# EAGLE design untitled (EAGLE 7.2.0)
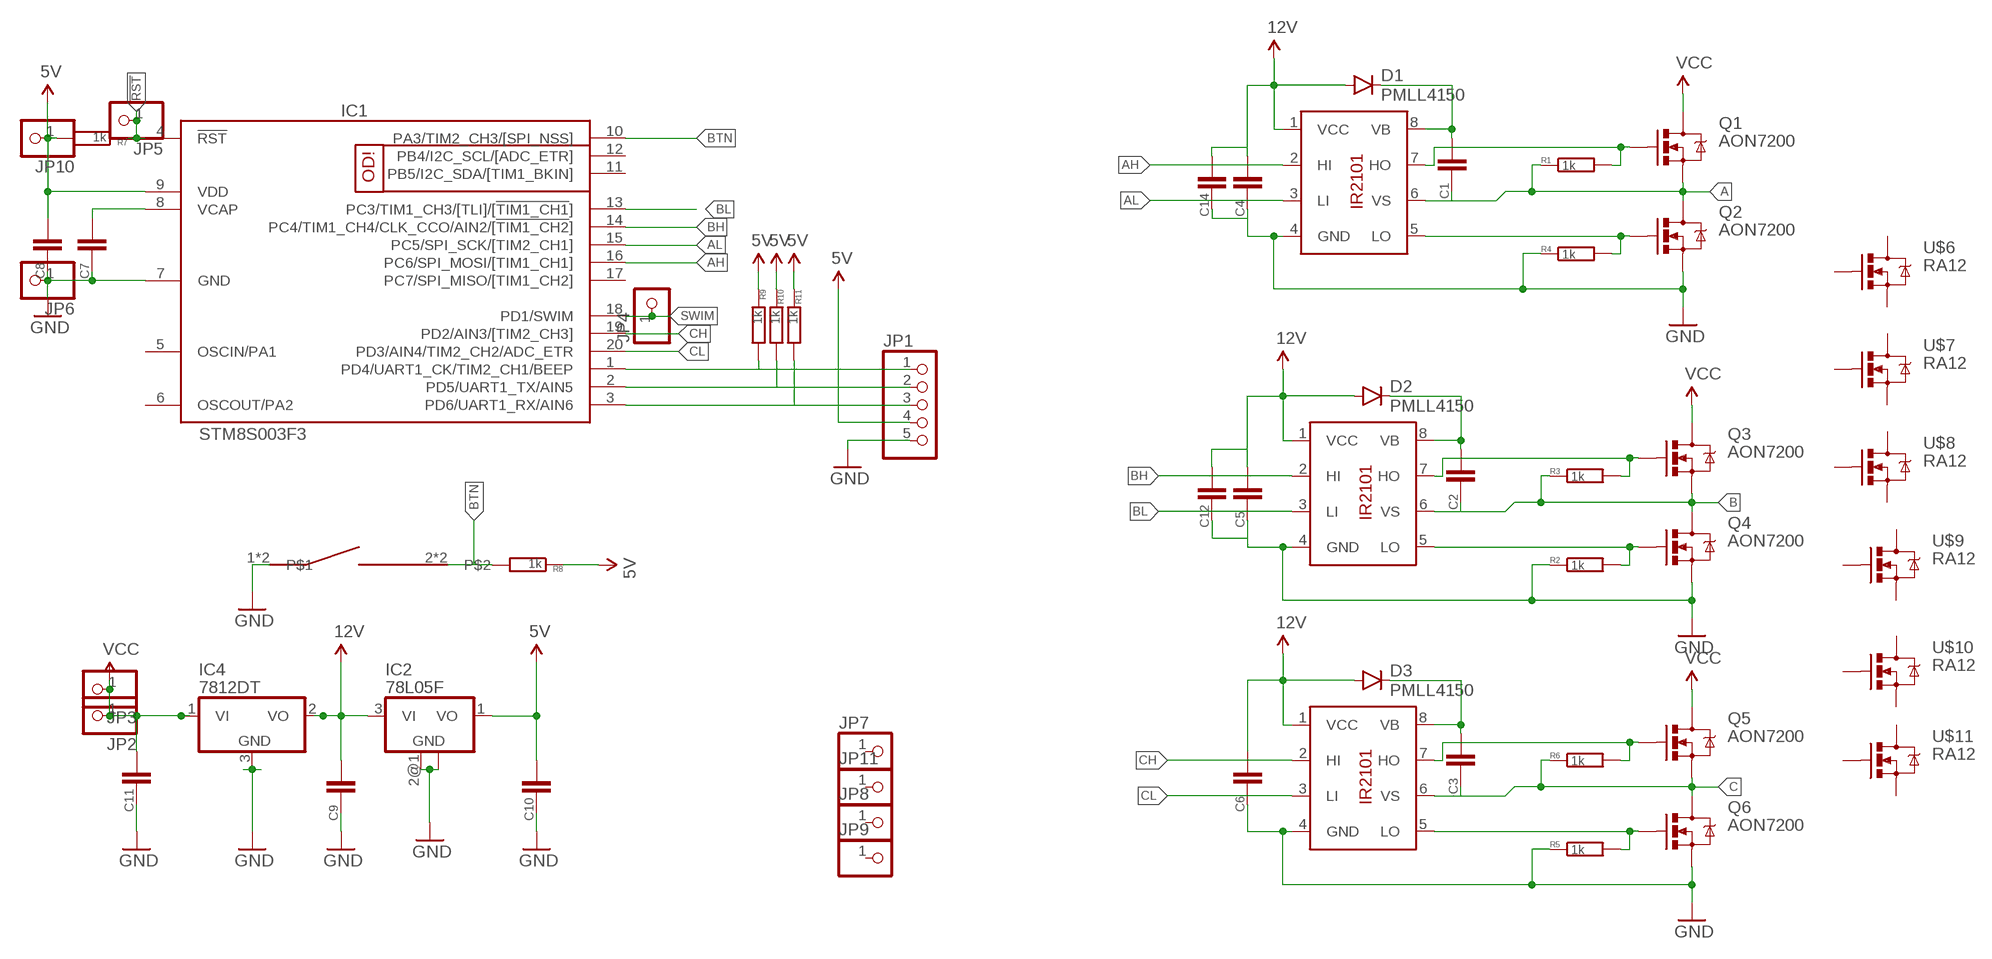
[diagram p0: schematic, sheet 1]

## Parts
C1  CC0805  [C0805]
C2  CC0805  [C0805]
C3  CC0805  [C0805]
C4  CC0805  [C0805]
C5  CC0805  [C0805]
C6  CC0805  [C0805]
C7  CC0603  [C0603]
C8  CC0805  [C0805]
C9  CC0805  [C0805]
C10  CC0805  [C0805]
C11  CC0805  [C0805]
C12  CC0805  [C0805]
C14  CC0805  [C0805]
D1  PMLL4150  [SOD80C]
D2  PMLL4150  [SOD80C]
D3  PMLL4150  [SOD80C]
IC1  STM8S003F3  [TSSOP20]
IC2  78L05F  [SOT89]
IC4  7812DT  [TO252]
JP1  PINHD-1X05_2.00  [1X05M]
JP2  PINHD-1X1  [1X01]
JP3  PINHD-1X1  [1X01]
JP4  PINHD-1X1  [1X01]
JP5  PINHD-1X1  [1X01]
JP6  PINHD-1X1  [1X01]
JP7  PINHD-1X01_2.54-90°  [1X01/90]
JP8  PINHD-1X01_2.54-90°  [1X01/90]
JP9  PINHD-1X01_2.54-90°  [1X01/90]
JP10  PINHD-1X1  [1X01]
JP11  PINHD-1X01_2.54-90°  [1X01/90]
Q1  AON7200  [DFN3X3]
Q2  AON7200  [DFN3X3]
Q3  AON7200  [DFN3X3]
Q4  AON7200  [DFN3X3]
Q5  AON7200  [DFN3X3]
Q6  AON7200  [DFN3X3]
R1  1k  R0603  [0603]
R2  1k  R0603  [0603]
R3  1k  R0603  [0603]
R4  1k  R0603  [0603]
R5  1k  R0603  [0603]
R6  1k  R0603  [0603]
R7  1k  R0603  [0603]
R8  1k  R0603  [0603]
R9  1k  R0603  [0603]
R10  1k  R0603  [0603]
R11  1k  R0603  [0603]
U$1  IR2101  [SO08]
U$2  IR2101  [SO08]
U$4  IR2101  [SO08]
U$5  BUTTON1  [BUTTON1]
U$6  RA12  [POWERPAK_SO8]
U$7  RA12  [POWERPAK_SO8]
U$8  RA12  [POWERPAK_SO8]
U$9  RA12  [POWERPAK_SO8]
U$10  RA12  [POWERPAK_SO8]
U$11  RA12  [POWERPAK_SO8]

## Nets
5V: C8.1 C10.1 IC1.9(VDD) IC2.1(VO) JP1.4 JP10.1 R7.2 R8.1 R9.1 R10.1 R11.1
12V: C4.1 C5.1 C6.1 C9.1 C12.1 C14.1 D1.A D2.A D3.A IC2.3(VI) IC4.2(VO) U$1.1(VCC) U$2.1(VCC) U$4.1(VCC)
!RST: IC1.4(!RST) JP5.1 R7.1
A: C1.2 Q1.S:1(S) Q1.S:2(S) Q1.S:3(S) Q2.D Q2.D:1(D) Q2.D:2(D) Q2.D:3(D) Q2.D:4(D) Q2.D:5(D) Q2.D:6(D) R1.1 U$1.6(VS)
AH: IC1.16(PC6/SPI_MOSI/[TIM1_CH1]) U$1.2(HI)
AL: IC1.15(PC5/SPI_SCK/[TIM2_CH1]) U$1.3(LI)
B: C2.2 Q3.S:1(S) Q3.S:2(S) Q3.S:3(S) Q4.D Q4.D:1(D) Q4.D:2(D) Q4.D:3(D) Q4.D:4(D) Q4.D:5(D) Q4.D:6(D) R3.1 U$2.6(VS)
BH: IC1.14(PC4/TIM1_CH4/CLK_CCO/AIN2/[!TIM1_CH2!]) U$2.2(HI)
BL: IC1.13(PC3/TIM1_CH3/[TLI]/[!TIM1_CH1!]) U$2.3(LI)
BTN: IC1.10(PA3/TIM2_CH3/[SPI_NSS]) R8.2 U$5.2 U$5.4
C: C3.2 Q5.S:1(S) Q5.S:2(S) Q5.S:3(S) Q6.D Q6.D:1(D) Q6.D:2(D) Q6.D:3(D) Q6.D:4(D) Q6.D:5(D) Q6.D:6(D) R6.1 U$4.6(VS)
CH: IC1.19(PD2/AIN3/[TIM2_CH3]) U$4.2(HI)
CL: IC1.20(PD3/AIN4/TIM2_CH2/ADC_ETR) U$4.3(LI)
GND: C4.2 C5.2 C6.2 C7.2 C8.2 C9.2 C10.2 C11.2 C12.2 C14.2 IC1.7(GND) IC2.2(GND) IC2.2@1(GND) IC4.3(GND) JP1.5 JP6.1 Q2.S:1(S) Q2.S:2(S) Q2.S:3(S) Q4.S:1(S) Q4.S:2(S) Q4.S:3(S) Q6.S:1(S) Q6.S:2(S) Q6.S:3(S) R2.1 R4.1 R5.1 U$1.4(GND) U$2.4(GND) U$4.4(GND) U$5.1 U$5.3
N$1: Q3.G R3.2 U$2.7(HO)
N$2: C2.1 D2.C U$2.8(VB)
N$3: Q4.G R2.2 U$2.5(LO)
N$4: Q1.G R1.2 U$1.7(HO)
N$5: C1.1 D1.C U$1.8(VB)
N$7: Q5.G R6.2 U$4.7(HO)
N$8: Q2.G R4.2 U$1.5(LO)
N$10: C3.1 D3.C U$4.8(VB)
N$11: Q6.G R5.2 U$4.5(LO)
N$13: IC1.1(PD4/UART1_CK/TIM2_CH1/BEEP) JP1.1 R9.2
N$14: IC1.2(PD5/UART1_TX/AIN5) JP1.2 R10.2
N$15: IC1.3(PD6/UART1_RX/AIN6) JP1.3 R11.2
N$19: C7.1 IC1.8(VCAP)
SWIM: IC1.18(PD1/SWIM) JP4.1
VCC: C11.1 IC4.1(VI) JP2.1 JP3.1 Q1.D Q1.D:1(D) Q1.D:2(D) Q1.D:3(D) Q1.D:4(D) Q1.D:5(D) Q1.D:6(D) Q3.D Q3.D:1(D) Q3.D:2(D) Q3.D:3(D) Q3.D:4(D) Q3.D:5(D) Q3.D:6(D) Q5.D Q5.D:1(D) Q5.D:2(D) Q5.D:3(D) Q5.D:4(D) Q5.D:5(D) Q5.D:6(D)
Unconnected: IC1.5(OSCIN/PA1) IC1.6(OSCOUT/PA2) IC1.11(PB5/I2C_SDA/[TIM1_BKIN]) IC1.12(PB4/I2C_SCL/[ADC_ETR]) IC1.17(PC7/SPI_MISO/[TIM1_CH2]) JP7.1 JP8.1 JP9.1 JP11.1 U$6.1(S) U$6.2(S) U$6.3(S) U$6.4(G) U$6.5(D) U$6.6(D) U$6.7(D) U$6.8(D) U$7.1(S) U$7.2(S) U$7.3(S) U$7.4(G) U$7.5(D) U$7.6(D) U$7.7(D) U$7.8(D) U$8.1(S) U$8.2(S) U$8.3(S) U$8.4(G) U$8.5(D) U$8.6(D) U$8.7(D) U$8.8(D) U$9.1(S) U$9.2(S) U$9.3(S) U$9.4(G) U$9.5(D) U$9.6(D) U$9.7(D) U$9.8(D) U$10.1(S) U$10.2(S) U$10.3(S) U$10.4(G) U$10.5(D) U$10.6(D) U$10.7(D) U$10.8(D) U$11.1(S) U$11.2(S) U$11.3(S) U$11.4(G) U$11.5(D) U$11.6(D) U$11.7(D) U$11.8(D)

## Library data of the parts
C1-C12 C14 = smalsmd:C: Capacitor
D1-D3 = DIODE:PMLL4150
IC1 = stm8:STM8S003: Value line, 16 MHz STM8S 8-bit MCU, 8 Kbytes Flash, 128 bytes data EEPROM, 10-bit ADC, 3 timers, UART, SPI, I2C
IC2 = linear:78L*: POSITOIV-VOLTAGE REGULATORS Output up to 100 mA Source: Datasheet <http://focus.ti.com/lit/ds/symlink/ua78l05.pdf>
IC4 = linear:78*: Positive VOLTAGE REGULATOR Source: http://cache.national.com/ds/LM/LM78L05.pdf http://www.fairchildsemi.com/ds/LM/LM7805.pdf
JP1 = pinhead-2:PINHD-1X05: PIN HEADER
JP2-JP6 JP10 = pinhead:PINHD-1X1: PIN HEADER
JP7-JP9 JP11 = pinhead-2:PINHD-1X01: PIN HEADER
Q1-Q6 = smalsmd:AON7200
R1-R11 = smalsmd:R
U$1 U$2 U$4 = gateDriver:IR2101
U$5 = smalsmd:BUTTON1
U$6-U$11 = CasaLibrary:RA12

## Board
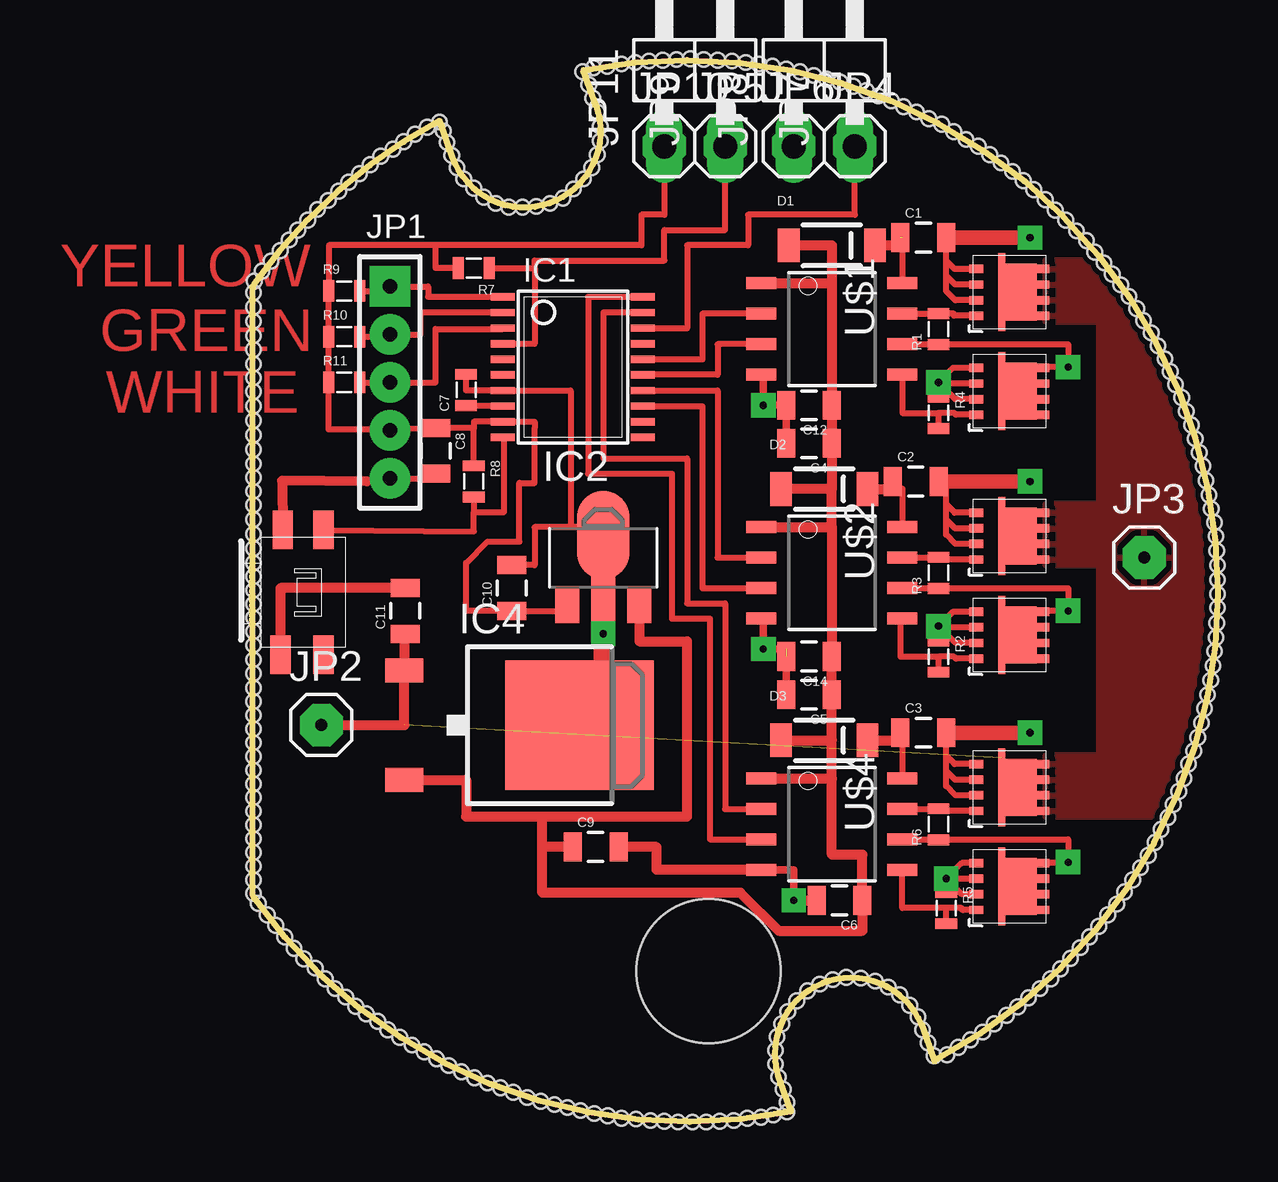
[diagram p1: board, top side]
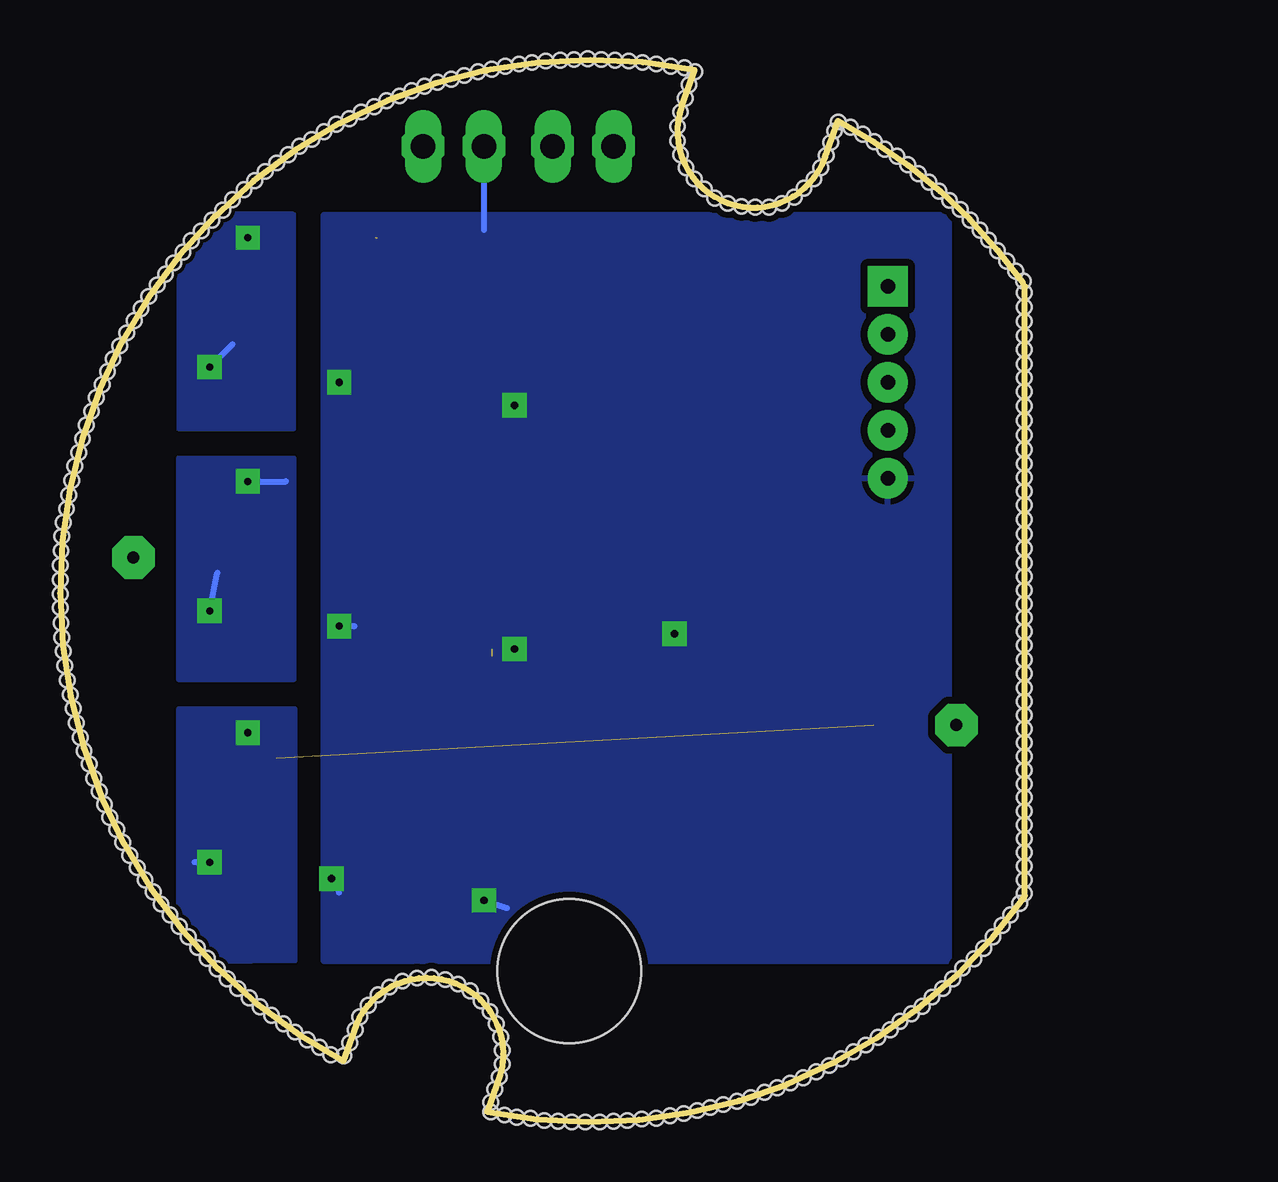
[diagram p2: board, bottom side, seen from below]

Size 40.2 x 44.26 mm. Coordinates in mm from the lower left corner, seen from the top.
Copper layers (1*16): Top 0.035mm / dielectric 1.5mm / Bottom 0.035mm
Design rules "default": minimum track width 0.2mm, minimum drill 0.2mm, track to track 0.2mm, track to pad 0.2mm, pad to pad 0.2mm, via to via 0.2mm, smd to smd 0.2mm, copper to edge 0.2mm, drill to drill 0.2mm, minimum pad ring 10mil, minimum via ring 8mil, stop-mask expansion 4mil, vias tented up to drill 0mil, thermal gap 10mil
Holes 0.6 mm at 0.02,34.57 0.02,33.97 0.02,33.36 0.02,32.76 0.02,32.19 0.02,31.59 0.02,31.02 0.02,30.44 0.02,29.84 0.02,29.24 0.02,28.63 0.02,28.03 0.02,27.43 0.02,26.86 0.02,26.28 0.02,25.71 0.02,25.11 0.02,24.51 0.02,23.9 0.02,23.3 0.02,22.73 0.02,22.16 0.02,21.59 0.02,21.01 0.02,20.44 0.02,19.87 0.02,19.27 0.02,18.7 0.02,18.09 0.02,17.52 0.02,16.95 0.02,16.38 0.02,15.81 0.02,15.24 0.02,14.66 0.02,14.09 0.02,13.52 0.02,12.95 0.02,12.38 0.02,11.81 0.02,11.23 0.02,10.66 0.02,10.09 0.02,9.52 0.21,9.11 0.59,8.63 0.94,8.19 1.32,7.71 1.71,7.23 2.12,6.79 2.59,6.41 3.01,5.96 3.42,5.55 3.86,5.2 4.28,4.82 4.72,4.5 5.2,4.19 5.61,3.84 6.12,3.52 6.63,3.2 7.13,2.92 7.64,2.63 8.15,2.34 8.69,2.09 9.23,1.84 9.77,1.61 10.31,1.42 10.85,1.23 11.42,1.01 11.99,0.85 12.56,0.73 13.1,0.6 13.64,0.47 14.22,0.34 14.79,0.25 15.36,0.15 15.96,0.12 16.56,0.06 17.14,0.03 17.71,0 18.31,0 18.88,0 19.45,0.03 20.03,0.06 20.6,0.15 21.17,0.19 21.68,0.28 22.25,0.41 22.25,0.82 22.09,1.36 21.9,1.87 21.77,2.41 21.77,2.98 21.84,3.55 22.03,4.09 22.28,4.6 22.66,5.04 23.11,5.46 23.61,5.74 24.15,5.93 24.72,6.03 25.33,6 25.93,5.87 26.47,5.62 26.95,5.3 27.36,4.85 27.71,4.38 27.9,3.84 28.12,3.3 28.38,2.76 28.92,2.79 29.39,3.11 29.9,3.42 30.41,3.74 30.88,4.09 31.39,4.44 31.87,4.79 32.31,5.17 32.79,5.55 33.23,5.96 33.65,6.38 34.06,6.82 34.47,7.27 34.85,7.71 35.23,8.16 35.61,8.63 36,9.08 36.31,9.58 36.66,10.09 36.98,10.6 37.3,11.11 37.58,11.65 37.84,12.19 38.12,12.7 38.35,13.24 38.57,13.77 38.79,14.31 38.98,14.92 39.2,15.46 39.36,16.03 39.52,16.63 39.65,17.24 39.77,17.81 39.9,18.41 40,19.01 40.06,19.62 40.12,20.19 40.15,20.79 40.19,21.43 40.19,22 40.19,22.6 40.19,23.2 40.15,23.81 40.12,24.41 40.06,24.98 39.93,25.55 39.84,26.13 39.71,26.73 39.58,27.33 39.42,27.9 39.27,28.48 39.11,29.05 38.88,29.62 38.69,30.19 38.44,30.73 38.22,31.27 38,31.81 37.71,32.35 37.42,32.89 37.11,33.4 36.82,33.9 36.5,34.41 36.15,34.89 35.81,35.33 35.46,35.81 35.07,36.25 34.73,36.73 34.31,37.14 33.87,37.59 33.42,38 33.01,38.44 32.53,38.86 32.09,39.24 31.65,39.62 31.17,39.97 30.69,40.32 30.22,40.67 29.71,40.95 29.2,41.27 28.69,41.59 28.15,41.81 27.65,42.1 27.11,42.32 26.6,42.57 26.06,42.76 25.55,42.98 25.01,43.18 24.47,43.33 23.9,43.46 23.36,43.62 22.79,43.78 22.22,43.87 21.64,44 21.07,44.1 20.53,44.16 19.96,44.22 19.36,44.25 18.79,44.29 18.22,44.32 17.64,44.29 17.07,44.25 16.5,44.22 15.93,44.16 15.36,44.1 14.75,44 14.18,43.94 13.74,43.78 13.99,43.24 14.15,42.67 14.34,42.1 14.47,41.49 14.47,40.89 14.34,40.32 14.12,39.78 13.77,39.3 13.36,38.89 12.91,38.51 12.37,38.29 11.8,38.16 11.23,38.13 10.66,38.13 10.12,38.29 9.61,38.54 9.2,38.92 8.79,39.3 8.5,39.78 8.28,40.29 8.09,40.83 7.93,41.3 7.77,41.68 7.26,41.46 6.75,41.18 6.28,40.86 5.83,40.54 5.33,40.25 4.88,39.91 4.44,39.52 3.99,39.17 3.58,38.79 3.13,38.41 2.69,38.03 2.28,37.59 1.86,37.17 1.52,36.76 1.13,36.32 0.75,35.87 0.37,35.46 0.05,35.05

### Footprints (pad centres in the part's own frame; a part is rotated, then mirrored left to right if it is on the bottom)
C0805 = smd 0.75 x 1.2: 1 -0.953,0; 2 0.953,0
C0603 = smd 0.45 x 0.9: 1 -0.65,0; 2 0.65,0
SOD80C = smd 0.9 x 1.4: A -1.8,0; C 1.8,0
TSSOP20 = smd 0.305 x 0.991: 1 -2.925,-2.918; 2 -2.275,-2.918; 3 -1.625,-2.918; 4 -0.975,-2.918; 5 -0.325,-2.918; 6 0.325,-2.918; 7 0.975,-2.918; 8 1.625,-2.918; 9 2.275,-2.918; 10 2.925,-2.918; 11 2.925,2.918; 12 2.275,2.918; 13 1.625,2.918; 14 0.975,2.918; 15 0.325,2.918; 16 -0.325,2.918; 17 -0.975,2.918; 18 -1.625,2.918; 19 -2.275,2.918; 20 -2.925,2.918
SOT89 = smd 1 x 1.5: 1 -1.499,-1.981; 3 1.499,-1.981 | smd 1 x 2: 2 0,-1.727 | smd 2.2 x 3.7: 2@1 0,0.94
TO252 = smd 1 x 1.6: 1 -2.28,-4.8; 2 2.28,-4.8 | smd 5.4 x 6.2: 3 0,2.5
1X05M = drill 0.6 pad 1.676 square: 1 -4,0 | drill 0.6 pad 1.676: 2 -2,0; 3 0,0; 4 2,0; 5 4,0
1X01 = drill 0.5 pad 1.778 octagon: 1 0,0
1X01/90 = drill 1.016 long: 1 -1.27,-3.81
DFN3X3 = smd 1.6 x 2.375: D -0.425,0.05 | smd 0.3 x 0.8: D:1 0.225,1.275; D:2 0.225,-1.175 | smd 0.6 x 0.35: D:3 -1.461,-0.916; D:4 -1.461,-0.266; D:5 -1.461,0.384; D:6 -1.461,1.034; G 1.289,1.034; S:1 1.289,0.384; S:2 1.289,-0.266; S:3 1.289,-0.916
0603 = smd 0.45 x 0.9: 1 -0.65,0; 2 0.65,0
SO08 = smd 0.5 x 1.25: 1 -1.905,-2.934; 2 -0.635,-2.934; 3 0.635,-2.934; 4 1.905,-2.934; 5 1.905,2.934; 6 0.635,2.934; 7 -0.635,2.934; 8 -1.905,2.934
AOKT-1 = hole 6: 16.008,1.202
BUTTON1 = smd 0.85 x 1.6: 1 0.9,4.9; 2 2.6,4.9; 3 0.8,-0.3; 4 2.6,-0.3
POWERPAK_SO8 = smd 0.66 x 0.5: 1 -2.921,1.778; 2 -2.921,0.508; 3 -2.921,-0.762; 4 -2.921,-2.032; 5 2.413,-2.032; 6 2.413,-0.762; 7 2.413,0.508; 8 2.413,1.778

### Placement (x,y rotation side)
C1  27.93,36.86 0 top
C2  27.61,26.7 0 top
C3  27.93,16.22 0 top
C4  23.17,28.28 180 top
C5  23.17,17.81 180 top
C6  24.44,9.23 180 top
C7  8.88,30.51 90 top
C8  7.61,27.97 270 top
C9  14.28,11.46 0 top
C10  10.79,22.25 90 top
C11  6.34,21.3 90 top
C12  23.17,29.87 180 top
C14  23.17,19.39 180 top
D1  24.12,36.54 0 top
D2  23.8,26.38 0 top
D3  23.8,15.9 0 top
IC1  13.33,31.46 270 top
IC2  14.6,23.52 0 top
IC4  11.1,16.54 270 top
JP1  5.71,30.82 270 top
JP2  2.85,16.54 0 top
JP3  37.14,23.52 0 top
JP4  25.07,40.67 0 top
JP5  19.68,40.67 0 top
JP6  22.53,40.67 0 top
JP7  26.34,44.48 0 top
JP8  23.8,44.48 0 top
JP9  20.95,44.48 0 top
JP10  17.14,40.67 0 top
JP11  18.41,44.48 0 top
Q1  31.42,34.63 180 top
Q2  31.42,30.51 180 top
Q3  31.42,24.47 180 top
Q4  31.42,20.35 180 top
Q5  31.42,14 180 top
Q6  31.42,9.87 180 top
R1  28.57,33.05 90 top
R2  28.57,19.39 270 top
R3  28.57,22.89 90 top
R4  28.57,29.55 270 top
R5  28.88,8.92 270 top
R6  28.57,12.41 90 top
R7  9.2,35.59 180 top
R8  9.2,26.7 270 top
R9  3.8,34.63 0 top
R10  3.8,32.73 0 top
R11  3.8,30.82 0 top
U$1  24.12,33.05 270 top
U$2  24.12,22.89 270 top
U$3  [AOKT-1]  17.78,22.29 270 top
U$4  24.12,12.41 270 top
U$5  0.34,19.78 0 top
U$6  51.33,37.46 0 top  (outside the outline)
U$7  49.55,27.84 0 top  (outside the outline)
U$8  49.65,20.41 0 top  (outside the outline)
U$9  49.74,13.39 0 top  (outside the outline)
U$10  49.9,6.41 0 top  (outside the outline)
U$11  50.22,-0.13 0 top  (outside the outline)

### Tracks (layer width: path | path; a pad name or v marks a point on that pad's centre or on a via)
5V
  Top 0.254: 9.2,28.92 9.2,29.18 IC1.9 11.74,29.18 11.74,28.92 11.74,28.73 11.74,26.63 11.1,26.63 11.1,24.19 9.77,24.19 8.88,23.3 8.88,21.3 C10.1 13.1,21.3 | 9.2,28.92 C8.1 5.71,28.87 3.15,28.87 R11.1 R10.1 R9.1 3.17,34.33 3.17,36.54 7.61,36.54 | R8.1 9.2,28.92 | R7.2 7.61,35.59 7.61,36.54 | JP10.1 17.14,37.81 16.18,37.81 16.18,36.54 7.61,36.54
  Top 0.305: 5.71,28.87 JP1.4
  Top 0.406: 13.1,21.3 IC2.1
12V
  Top 0.406: D1.A 24.12,36.54 24.12,34.95 | 24.12,34.95 C12.1 C4.1 24.12,26.38 | 24.12,26.38 D2.A | U$1.1 24.12,34.95 | U$2.1 24.12,24.79 | 24.12,24.79 24.12,26.38 | U$4.1 24.12,14.31 | 24.12,14.31 24.12,15.9 | D3.A 24.12,15.9 | 24.12,14.31 24.12,11.14 25.39,11.14 C6.1 25.39,7.97 21.9,7.97 20.31,9.55 12.06,9.55 12.06,11.46 | 24.12,24.79 C14.1 C5.1 24.12,15.9 | IC2.3 16.1,20.03 18.09,20.03 18.09,12.73 12.06,12.73 | IC4.2 8.88,14.26 8.88,12.73 12.06,12.73 | C9.1 12.06,11.46 | 12.06,11.46 12.06,12.73
!RST
  Top 0.254: R7.1 11.74,35.59 | 11.74,35.59 11.74,32.43 IC1.4 | 11.74,35.59 11.74,35.9 17.14,35.9 17.14,37.18 19.68,37.18 JP5.1
A  (via drill 0.3 pad 1.02)
  Top 0.254: U$1.6 28.57,32.41 R1.1 33.96,32.4 | 30.15,34.25 Q1.S:1 29.27,34.25 28.88,34.64 28.88,35.27 | Q2.D:3 32.89,31.46 v33.96,31.46 33.96,32.4 | 28.88,36.54 C1.2 28.88,35.9 | 30.15,35.59 30.15,35.55 Q1.S:3 29.24,35.55 28.88,35.9 | 28.88,35.27 28.88,35.9 | 33.96,32.41 33.96,32.4 | Q1.S:2 29.25,34.9 28.88,35.27
  Top 0.61: C1.2 v32.38,36.86
  Bottom 0.254: v33.96,31.46 33.01,32.41
  pour Bottom (no thermals): 30.47,37.81 33.65,37.81 35.23,35.59 35.23,28.92 30.47,28.92
AH
  Top 0.254: U$1.2 18.72,33.68 18.72,31.78 IC1.16
AL
  Top 0.254: U$1.3 19.36,32.41 19.36,31.14 IC1.15
B  (via drill 0.3 pad 1.02)
  Top 0.254: U$2.6 28.57,22.25 | 28.57,22.25 R3.1 | Q4.D:3 32.89,21.3 v33.96,21.3 33.96,22.25 28.57,22.25 | 30.15,24.09 Q3.S:1 29.27,24.09 28.88,24.48 28.88,25.11 | 30.14,25.43 Q3.S:3 29.24,25.39 28.88,25.75 | Q3.S:2 29.25,24.74 28.88,25.11 | 28.88,25.11 28.88,25.75 | 28.88,25.75 28.88,26.38 C2.2
  Top 0.61: v32.38,26.7 C2.2
  Bottom 0.254: v32.38,26.7 30.79,26.7 | v33.96,21.3 33.65,22.89
  pour Bottom: 30.47,27.65 30.47,18.44 35.23,18.44 35.23,27.65
BH
  Top 0.254: IC1.14 19.36,30.48 19.36,23.52 U$2.2
BL
  Top 0.254: IC1.13 18.72,29.84 18.72,22.25 U$2.3
BTN
  Top 0.254: IC1.10 10.47,28.54 10.47,25.43 9.2,25.43 | R8.2 9.2,25.43 | U$5.2 9.2,24.61 9.2,25.43
C  (via drill 0.3 pad 1.02)
  Top 0.254: U$4.6 28.57,11.78 | Q6.D:2 31.2,10.82 v33.96,10.82 33.96,11.78 28.57,11.78 | 30.14,14.95 Q5.S:3 29.24,14.91 28.88,15.27 | 28.88,14.63 28.88,15.27 | 28.88,15.27 C3.2 | R6.1 28.57,11.78 | Q5.S:1 29.27,13.61 28.88,14 28.88,14.63 | Q5.S:2 29.25,14.26 28.88,14.63
  Top 0.61: C3.2 v32.38,16.22
  Bottom 0.254: v33.96,10.82 34.6,10.82
  pour Bottom: 30.44,17.2 30.44,6.73 33.96,6.69 34.6,7.33 35.23,8.28 35.23,17.2
CH
  Top 0.254: U$4.2 19.68,13.05 19.68,21.62 18.09,21.62 18.09,27.65 14.6,27.65 14.6,33.74 IC1.19
CL
  Top 0.254: U$4.3 19.04,11.78 19.04,20.98 17.45,20.98 17.45,27.02 13.96,27.02 13.96,34.39 IC1.20
GND  (via drill 0.3 pad 1.02)  (1 unrouted)
  Top 0.254: 30.15,30.12 Q2.S:1 29.27,30.12 v28.57,30.82 | U$1.4 21.26,31.14 | Q4.S:2 28.57,20.61 v28.57,20.66 | U$2.4 21.26,20.98 | Q6.S:2 v28.88,10.14 | C7.2 8.88,30.48 IC1.7 13.23,30.48 13.23,24.79 | C8.2 7.93,26.82 JP1.5 5.71,26.7 4.75,26.7 | 11.1,23.2 11.74,23.2 11.74,24.79 13.23,24.79 | U$5.3 1.16,19.48 | R5.1 v28.88,10.14 | 28.57,20.03 R2.1 v28.57,20.66 | v28.57,30.82 R4.1 | 13.23,24.79 14.27,24.79 IC2.2@1 IC2.2 | Q2.S:3 29.17,31.42 v28.57,30.82 | Q2.S:2 28.62,30.77 v28.57,30.82 | Q4.S:3 29.17,21.26 v28.57,20.66 | Q4.S:1 29.27,19.96 v28.57,20.66 | Q6.S:3 29.53,10.79 v28.88,10.14 | Q6.S:1 29.53,9.49 v28.88,10.14
  Top 0.305: 21.26,31.14 v21.26,29.87 C12.2 C4.2 | 21.26,20.98 v21.26,19.71 22.22,19.71 C5.2 | U$4.4 22.53,10.5 v22.53,9.23
  Top 0.406: 14.6,16.54 IC4.3 | C10.2 11.1,23.2 | U$4.4 16.82,10.5 16.82,11.46 C9.2 | v22.53,9.23 C6.2 | C11.2 1.14,22.25 U$5.3 | 4.75,26.7 1.21,26.73 U$5.1
  Top 0.813: IC2.2 v14.6,20.35 14.6,16.54
  Bottom 0.254: v28.57,30.82 28.57,31.14 | v21.26,29.87 21.26,30.19 | v28.57,20.66 27.93,20.66 | v22.53,9.23 21.58,8.92 | v28.88,10.14 28.57,9.55 | JP6.1 22.53,37.18
  pour Bottom (isolate 0.3): 3.17,37.81 3.17,6.69 29.2,6.69 29.2,37.81
N$1
  Top 0.254: U$2.7 28.25,23.52 R3.2 28.57,23.44 Q3.G
N$2
  Top 0.254: C2.1 27.06,26.38 U$2.8
  Top 0.406: D2.C 26.66,26.38 C2.1
N$3
  Top 0.254: U$2.5 26.98,20.91 26.98,19.39 28.57,19.39 | R2.2 28.57,19.39 | Q4.G 29.28,19.31 29.2,19.39 28.57,19.39
N$4
  Top 0.254: U$1.7 28.57,33.68 | Q1.G 29.2,33.6 29.2,33.68 28.57,33.68 | 28.57,33.68 R1.2
N$5  (1 unrouted)
  Top 0.254: 27.06,36.86 U$1.8
  Top 0.406: D1.C 26.98,36.54 C1.1
N$7
  Top 0.254: U$4.7 28.57,13.05 R6.2 28.57,12.96 Q5.G
N$8
  Top 0.254: U$1.5 27.06,29.55 28.57,29.55 | R4.2 28.57,29.55 | Q2.G 29.28,29.47 29.2,29.55 28.57,29.55
N$10
  Top 0.254: C3.1 27.06,16.22 U$4.8
  Top 0.406: D3.C 26.98,15.9 C3.1
N$11
  Top 0.254: 28.88,8.92 27.06,8.92 U$4.5 | R5.2 28.88,8.92 | Q6.G 29.6,8.84 arc-90 29.52,8.92 28.88,8.92
N$13
  Top 0.254: IC1.1 7.29,34.39 7.29,34.82 JP1.1 5.71,34.64 R9.2
N$14
  Top 0.254: IC1.2 6.98,33.74 6.98,32.82 JP1.2 5.71,32.73 R10.2
N$15
  Top 0.254: IC1.3 10.41,33.05 7.61,33.05 7.61,30.82 JP1.3 R11.2
N$19
  Top 0.254: IC1.8 9.18,29.84 C7.1
SWIM
  Top 0.254: IC1.18 18.09,33.08 18.09,36.54 20.63,36.54 20.63,37.81 25.07,37.81 JP4.1
VCC  (1 unrouted)
  Top 0.406: JP2.1 6.3,16.54 IC4.1 6.3,20.35 C11.1
  pour Top (isolate 0.254): 33.01,35.9 33.01,33.36 35.23,33.36 35.23,25.74 33.01,25.74 33.01,23.2 35.23,23.2 35.23,15.27 33.01,15.27 33.01,12.73 38.09,12.73 40,18.44 40.31,21.62 40,24.16 38.41,30.51 38.73,30.51 37.77,31.78 37.14,33.36 34.92,35.9

### Text on the board
Top: YELLOW | GREEN | WHITE